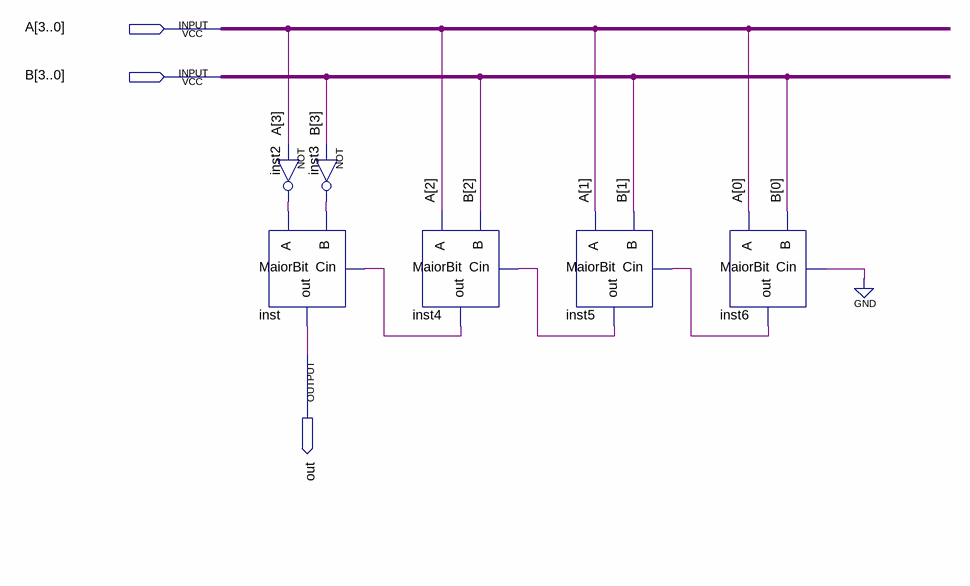
[diagram p0: schematic sheet]
// Quartus schematic Maior.bdf as structural Verilog: 6 symbols, 3 pins
module Maior (
  input  [3:0] A,
  input  [3:0] B,
  output out
);

  wire inst2_out, inst3_out, inst4_out, inst5_out, inst6_out;

  not inst2 (inst2_out, A[3]);
  MaiorBit inst (.A(inst2_out), .B(inst3_out), .Cin(inst4_out), .out(out));
  not inst3 (inst3_out, B[3]);
  MaiorBit inst4 (.A(A[2]), .B(B[2]), .Cin(inst5_out), .out(inst4_out));
  MaiorBit inst5 (.A(A[1]), .B(B[1]), .Cin(inst6_out), .out(inst5_out));
  MaiorBit inst6 (.A(A[0]), .B(B[0]), .Cin(1'b0), .out(inst6_out));
endmodule
